# Altium schematic sheet analog_outputs_blk.SchDoc
size A4; Engineer: JBayalas; DocumentNumber: 6; Revision: V4.3.0; SheetNumber: 6; SheetTotal: 12
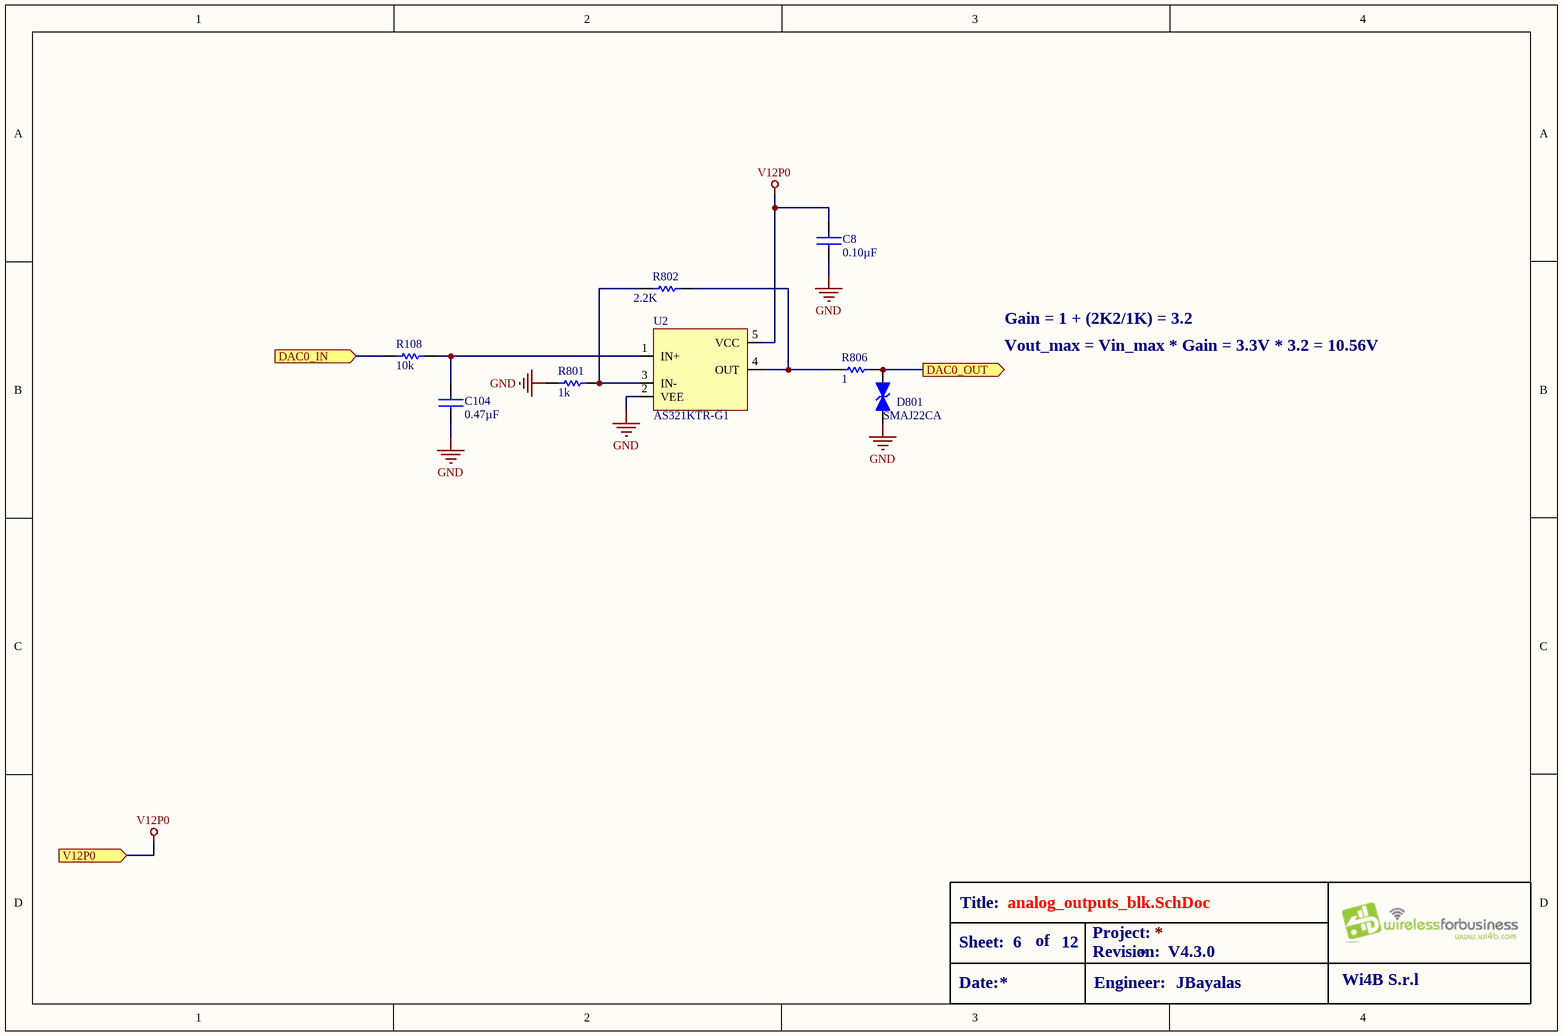
[diagram p0: analog_outputs_blk.SchDoc]

## Parts
C8  value 0.10µF  [C0402]  (hidden comment: GRM155R71H104ME14D)
C104  value 0.47µF  [C0603]  (hidden comment: GRM188R71C474KA88D)
D801  SMAJ22CA  [DO-214AC]
R108  value 10k  [R0402]  (hidden comment: ERJ-2RKF1002X)
R801  value 1k  [R0402]  (hidden comment: ERJ-2RKF1001X)
R802  value 2.2K  [R0603]  (hidden comment: CRCW06032K20FKEA)
R806  value 1  [R0402]  (hidden comment: CRCW04021R00FKED)
U2  AS321KTR-G1  [SOT-23-5]

## Ports
DAC0_IN (in), DAC0_OUT (out), V12P0 (in)

## Nets
GND: C8.2 C104.2 D801.2(K) R801.1 U2.2(VEE)
V12P0: C8.1 U2.5(VCC) ; port V12P0
DAC0_IN: R108.1 ; port DAC0_IN
DAC0_OUT: D801.1(A) R806.2 ; port DAC0_OUT
NetC104_1: C104.1 R108.2 U2.1(IN+)
NetR801_2: R801.2 R802.1 U2.3(IN-)
NetR802_2: R802.2 R806.1 U2.4(OUT)

## Notes on the sheet
- Gain = 1 + (2K2/1K) = 3.2
- Vout_max = Vin_max * Gain = 3.3V * 3.2 = 10.56V
- Title:
- Sheet:
- Date:
- of
- Project:
- Revision:
- Engineer:
- Wi4B S.r.l

## Library data of the parts
C8 = GRM155R71H104ME14D: CAP CER 0.1UF 50V X7R 0402; MFT: Murata Electronics North America; TYPE: SMD; FUNCTION: analog outputs; MPN: GRM155R71H104ME14D; RATING: 50V; DNP: *; Parameter 1: *
C104 = GRM188R71C474KA88D: CAP CER 0.47UF 16V X7R 0603; MFT: Murata Electronics North America; TYPE: SMD; FUNCTION: analog outputs; MPN: GRM188R71C474KA88D; RATING: 16V; DNP: *
D801 = SMAJ22CA: TVS Diodes - Transient Voltage Suppressors 22Vr 400W 11.3A 5% BiDirectional; MFT: Littelfuse; TYPE: SMD/SMT; RATING: 22 V; ALT MFT: Bytesonic; FUNCTION: analog outputs; VALUE: SMAJ22CA; MPN: SMAJ22CA; ALT DESC: *; ALT MPN: SMAJ22CA
R108 = ERJ-2RKF1002X: RES SMD 10K OHM 1% 1/10W 0402; MFT: Panasonic Electronic Components; RATING: 0.1W, 1/10W; FUNCTION: analog outputs; MPN: ERJ-2RKF1002X; TYPE: Surface Mount
R801 = ERJ-2RKF1001X: RES SMD 1K OHM 1% 1/10W 0402; MFT: Panasonic Electronic Components; RATING: 0.1W, 1/10W; FUNCTION: analog outputs; MPN: ERJ-2RKF1001X; TYPE: Surface Mount
R802 = CRCW06032K20FKEA: RES SMD 2.2K OHM 1% 1/10W 0603; MFT: Vishay Dale; FUNCTION: analog outputs; MPN: CRCW06032K20FKEA; RATING: *; LOAD: *; TYPE: SMD
R806 = CRCW04021R00FKED: RES SMD 1 OHM 1% 1/16W 0402; MFT: Vishay Dale; FUNCTION: analog outputs; MPN: CRCW04021R00FKED; TYPE: SMD; RATING: 1/16W; DNP: *
U2 = AS321KTR-G1: IC OPAMP GP 1 CIRCUIT SOT25; MFT: Diodes Incorporated; FUNCTION: analog outputs; MPN: AS321KTR-G1; TYPE: SMD; LOAD: *; RATING: *; APN: *; VALUE: AS321KTR-G1